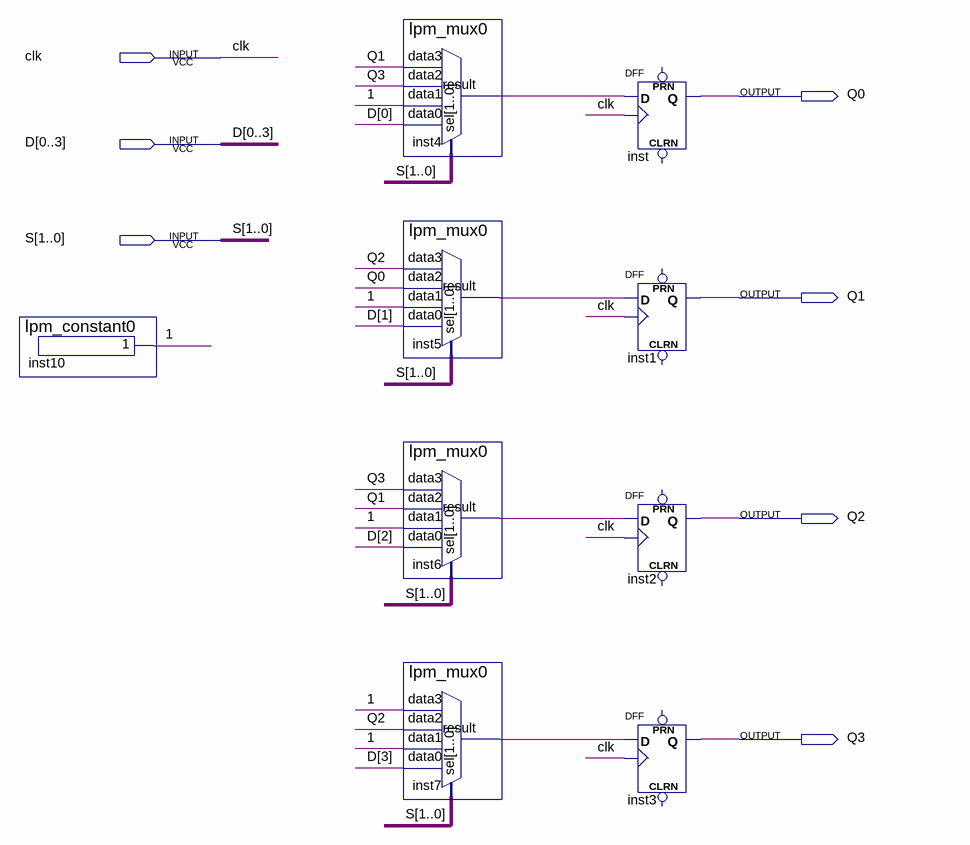
[diagram p0: schematic sheet]
// Quartus schematic lab_4_multireg.bdf as structural Verilog: 9 symbols, 7 pins
module lab_4_multireg (
  input  clk,
  input  [0:3] D,
  input  [1:0] S,
  output Q0,
  output Q1,
  output Q2,
  output Q3
);

  wire \1 , inst4_result, inst5_result, inst6_result, inst7_result;

  lpm_constant0 inst10 (.result(\1 ));
  lpm_mux0 inst4 (.data3(Q1), .data2(Q3), .data1(\1 ), .data0(D[0]), .sel(S), .result(inst4_result));
  lpm_mux0 inst5 (.data3(Q2), .data2(Q0), .data1(\1 ), .data0(D[1]), .sel(S), .result(inst5_result));
  lpm_mux0 inst6 (.data3(Q3), .data2(Q1), .data1(\1 ), .data0(D[2]), .sel(S), .result(inst6_result));
  lpm_mux0 inst7 (.data3(\1 ), .data2(Q2), .data1(\1 ), .data0(D[3]), .sel(S), .result(inst7_result));
  DFF inst (.CLK(clk), .D(inst4_result), .Q(Q0));  // open: CLRN, PRN
  DFF inst1 (.CLK(clk), .D(inst5_result), .Q(Q1));  // open: CLRN, PRN
  DFF inst2 (.CLK(clk), .D(inst6_result), .Q(Q2));  // open: CLRN, PRN
  DFF inst3 (.CLK(clk), .D(inst7_result), .Q(Q3));  // open: CLRN, PRN
endmodule
